# Altium schematic sheet Peripherals.SchDoc
size A
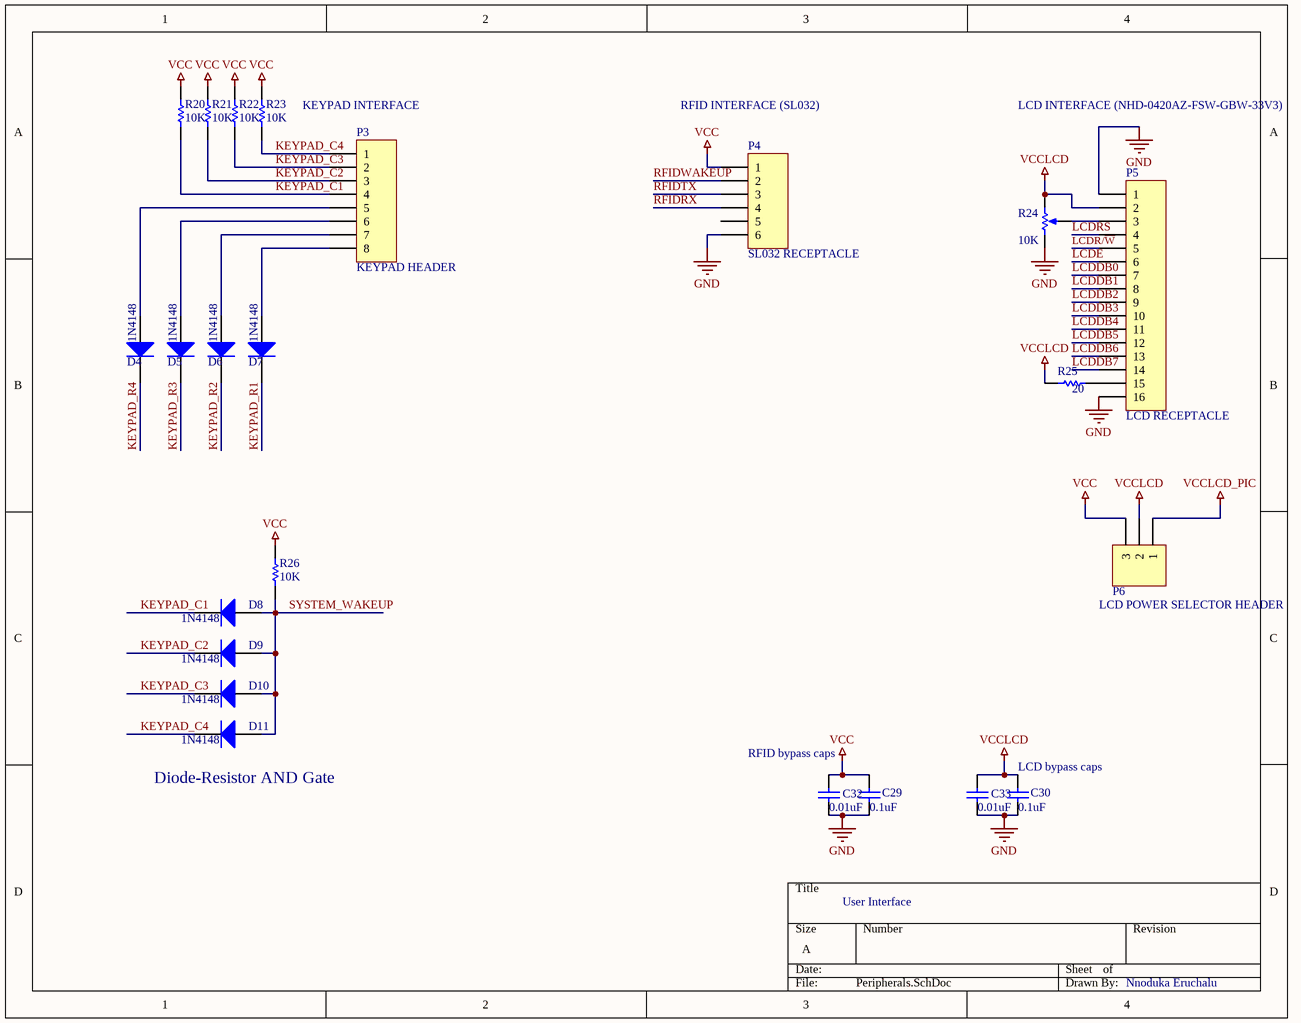
[diagram p0: Peripherals.SchDoc]

## Parts
C29  value 0.1uF  [2012[0805]]  (hidden comment: C2012X7R1H104K/0.85)
C30  value 0.1uF  [2012[0805]]  (hidden comment: C2012X7R1H104K/0.85)
C32  value 0.01uF  [2012[0805]]  (hidden comment: C2012X7R2E103K)
C33  value 0.01uF  [2012[0805]]  (hidden comment: C2012X7R2E103K)
D4  1N4148  [SOD123]
D5  1N4148  [SOD123]
D6  1N4148  [SOD123]
D7  1N4148  [SOD123]
D8  1N4148  [SOD123]
D9  1N4148  [SOD123]
D10  1N4148  [SOD123]
D11  1N4148  [SOD123]
P3  KEYPAD HEADER  [HDR1X8]
P4  SL032 RECEPTACLE  [HDR1X6]
P5  LCD RECEPTACLE  [HDR1X16]
P6  LCD POWER SELECTOR HEADER  [HDR1X3]
R20  value 10K  [2012[0805]]  (hidden comment: ERJ-6GEYJ103V)
R21  value 10K  [2012[0805]]  (hidden comment: ERJ-6GEYJ103V)
R22  value 10K  [2012[0805]]  (hidden comment: ERJ-6GEYJ103V)
R23  value 10K  [2012[0805]]  (hidden comment: ERJ-6GEYJ103V)
R24  value 10K  [TC33]  (hidden comment: TC33X-2-103E)
R25  value 20  [2012[0805]]  (hidden comment: ERJ-6GEYJ200V)
R26  value 10K  [2012[0805]]  (hidden comment: ERJ-6GEYJ103V)

## Nets
GND: C29.1 C30.1 C32.1 C33.1 P4.6 P5.1 P5.16 R24.1(TOP)
VCC: C29.2 C32.2 P4.1 P6.3 R20.1 R21.1 R22.1 R23.1 R26.1
VCCLCD: C30.2 C33.2 P5.2 P6.2 R24.2(BOT) R25.1
VCCLCD_PIC: P6.1
KEYPAD_C1: D8.2(K) P3.4 R20.2
KEYPAD_C2: D9.2(K) P3.3 R21.2
KEYPAD_C3: D10.2(K) P3.2 R22.2
KEYPAD_C4: D11.2(K) P3.1 R23.2
KEYPAD_R1: D7.2(K)
KEYPAD_R2: D6.2(K)
KEYPAD_R3: D5.2(K)
KEYPAD_R4: D4.2(K)
LCDDB0: P5.7
LCDDB1: P5.8
LCDDB2: P5.9
LCDDB3: P5.10
LCDDB4: P5.11
LCDDB5: P5.12
LCDDB6: P5.13
LCDDB7: P5.14
LCDE: P5.6
LCDR/~{W}: P5.5
LCDRS: P5.4
RFIDRX: P4.4
RFIDTX: P4.3
RFIDWAKEUP: P4.2
SYSTEM_WAKEUP: D8.1(A) D9.1(A) D10.1(A) D11.1(A) R26.2
NetD4_1: D4.1(A) P3.5
NetD5_1: D5.1(A) P3.6
NetD6_1: D6.1(A) P3.7
NetD7_1: D7.1(A) P3.8
NetP5_3: P5.3 R24.3(TAP)
NetP5_15: P5.15 R25.2

Not connected (* = marked no-connect by the designer): P4 5

## Notes on the sheet
- KEYPAD INTERFACE
- RFID INTERFACE (SL032)
- LCD INTERFACE (NHD-0420AZ-FSW-GBW-33V3)
- RFID bypass caps
- (near C30) LCD bypass caps
- (near D11) Diode-Resistor AND Gate
- User Interface
- Nnoduka Eruchalu

## Library data of the parts
C29 C30 C32 C33 = C0805: Ceramic Chip Capacitor - Standard; Note: Footprint corresponds to dimensions for bulk cassette packaging. This case size has tightened tolerances.; Published: 17-Jul-2002; LatestRevisionDate: 19-Mar-2004; LatestRevisionNote: Silkscreen size reduced.; DatasheetDocument: Mar-2001; PackageDocument: Mar-2001; PackageReference: 0805; Publisher: Altium Limited; Code_JEITA: 0805; Code_IPC: 2012[0805]; ComponentLink1Description: Manufacturer Link; ComponentLink1URL: http://www.kemet.com/; ComponentLink2Description: Datasheet; ComponentLink2URL: http://www.kemet.com/kemet/web/homepage/kechome.nsf/vapubfilesname/F3102TA.pdf/$file/F3102TA.pdf
D4-D11 = Diode 1N4148: High Conductance Fast Diode; Published: 8-Jun-2000; LatestRevisionDate: 17-Jul-2002; LatestRevisionNote: Re-released for DXP Platform.; DatasheetDocument: 1997; PackageReference: DO-35; Publisher: Altium Limited; Code_JEDEC: DO-204-AH; ComponentLink1Description: Manufacturer Link; ComponentLink1URL: http://www.fairchildsemi.com/; ComponentLink2Description: Datasheet; ComponentLink2URL: http://www.fairchildsemi.com/ds/1N%2F1N4148.pdf
P3 = Header 8: Header, 8-Pin; LatestRevisionDate: 17-Jul-2002; LatestRevisionNote: Re-released for DXP Platform.; Publisher: Altium Limited
P4 = Header 6: Header, 6-Pin; LatestRevisionDate: 17-Jul-2002; LatestRevisionNote: Re-released for DXP Platform.; Publisher: Altium Limited
P5 = Header 16: Header, 16-Pin; LatestRevisionDate: 17-Jul-2002; LatestRevisionNote: Re-released for DXP Platform.; Publisher: Altium Limited
P6 = Header 3: Header, 3-Pin; LatestRevisionDate: 17-Jul-2002; LatestRevisionNote: Re-released for DXP Platform.; Publisher: Altium Limited
R20-R23 R25 R26 = Res1: Resistor; Published: 8-Jun-2000; LatestRevisionDate: 17-Jul-2002; LatestRevisionNote: Re-released for DXP Platform.; PackageReference: AXIAL-0.3; Publisher: Altium Limited
R24 = RPot: Potentiometer; Sim Note: Enter the Resistance value and the set point into parameter fields.; Set Position: 0.5; Published: 8-Jun-2000; LatestRevisionDate: 17-Jul-2002; LatestRevisionNote: Re-released for DXP Platform.; PackageReference: VR5; Publisher: Altium Limited